# Altium schematic sheet IMU.SchDoc
size A
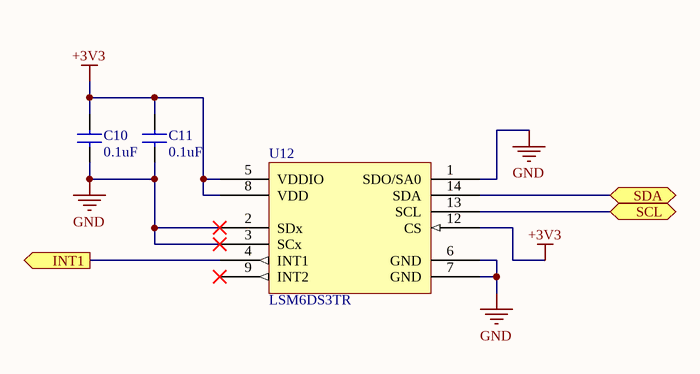
[diagram p0: IMU.SchDoc]

## Parts
C10  value 0.1uF  [0402_CAPACITOR]  (hidden comment: CAP 0.1uF 16V X7R)
C11  value 0.1uF  [0402_CAPACITOR]  (hidden comment: CAP 0.1uF 16V X7R)
U12  LSM6DS3TR  [LGA-14_2.5x3mm]

## Ports
INT1 (out), SCL (bidir), SDA (bidir)

## Nets
+3V3: C10.2 C11.2 U12.5(VDDIO) U12.8(VDD) U12.12(CS)
GND: C10.1 C11.1 U12.1(SDO/SA0) U12.2(SDx) U12.3(SCx) U12.6(GND) U12.7(GND)
INT1: U12.4(INT1) ; port INT1
SCL: U12.13(SCL) ; port SCL
SDA: U12.14(SDA) ; port SDA

Not connected (* = marked no-connect by the designer): U12 9(INT2)*

## Library data of the parts
C10 C11 = C_0402_0.1uF_16V_10%: CAP CERM 0.1uF 10% 16V 0402; Package: =SelectedPackage; Voltage: 16V; Temperature Coefficient: X7R; Supplier 1: Digi-Key; Supplier Part Number 1: 1276-1001-1-ND; Supplier 2: Digi-Key; Supplier Part Number 2: 587-1451-1-ND
U12 = U_LSM6DS3: Accelerometer, Gyroscope, Temperature, 3 Axis Sensor I²C, SPI Output; Supplier 1: Digi-Key; Supplier 2: Mouser; Supplier Part Number 1: 497-15383-1-ND; Supplier Part Number 2: 511-LSM6DS3TR